# EAGLE schematic board (EAGLE 9.6.2)
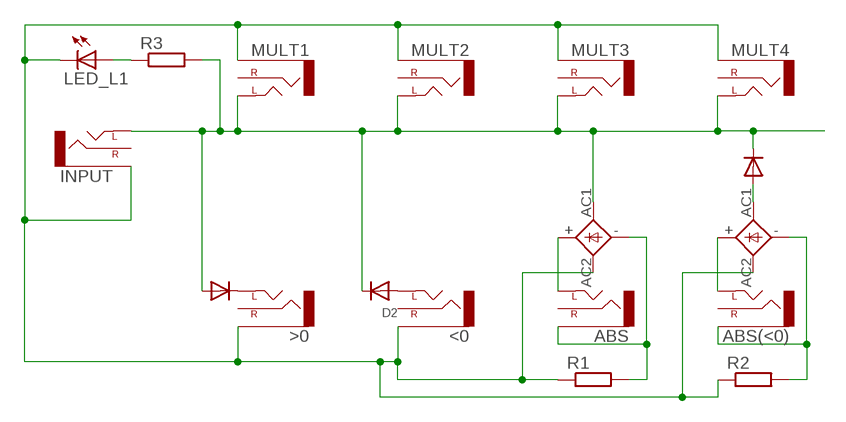
[diagram p0: schematic, sheet 1]

## Parts
<0  THONKI-STEREO  [WQP-PJ366ST_JACK]
>0  THONKI-STEREO  [WQP-PJ366ST_JACK]
ABS  THONKI-STEREO  [WQP-PJ366ST_JACK]
ABS(<0)  THONKI-STEREO  [WQP-PJ366ST_JACK]
B1  2KBB-R  [2KBB-R]
B2  2KBB-R  [2KBB-R]
D1  DIODEDO-1N4148  [DO-1N4148]
D2  DIODEDO-1N4148  [DO-1N4148]
D3  DIODEDO-1N4148  [DO-1N4148]
INPUT  THONKI-STEREO  [WQP-PJ366ST_JACK]
LED_L1  LED3MM  [LED3MM]
MULT1  THONKI-STEREO  [WQP-PJ366ST_JACK]
MULT2  THONKI-STEREO  [WQP-PJ366ST_JACK]
MULT3  THONKI-STEREO  [WQP-PJ366ST_JACK]
MULT4  THONKI-STEREO  [WQP-PJ366ST_JACK]
R1  RESISTOR7MM  [7MM_RESISTOR]
R2  RESISTOR7MM  [7MM_RESISTOR]
R3  RESISTOR7MM  [7MM_RESISTOR]

## Nets
N$1: ABS(<0).P$1_TIP(LEFT) B2.+
N$2: >0.P$1_TIP(LEFT) D1.C
N$3: B2.AC1 D3.A
N$4: LED_L1.A R3.1
N$5: <0.P$1_TIP(LEFT) D2.A
N$6: B1.AC1 D1.A D2.C D3.C INPUT.P$1_TIP(LEFT) MULT1.P$1_TIP(LEFT) MULT2.P$1_TIP(LEFT) MULT3.P$1_TIP(LEFT) MULT4.P$1_TIP(LEFT) R3.2
N$7: <0.P$3_SLEEVE(SLEEVE) >0.P$3_SLEEVE(SLEEVE) B1.AC2 B2.AC2 INPUT.P$3_SLEEVE(SLEEVE) LED_L1.K(C) MULT1.P$3_SLEEVE(SLEEVE) MULT2.P$3_SLEEVE(SLEEVE) MULT3.P$3_SLEEVE(SLEEVE) MULT4.P$3_SLEEVE(SLEEVE) R1.1 R2.1
N$8: ABS.P$3_SLEEVE(SLEEVE) B1.- R1.2
N$9: ABS.P$1_TIP(LEFT) B1.+
N$10: ABS(<0).P$3_SLEEVE(SLEEVE) B2.- R2.2
Unconnected: <0.P$2_SWITCH(RIGHT) >0.P$2_SWITCH(RIGHT) ABS(<0).P$2_SWITCH(RIGHT) ABS.P$2_SWITCH(RIGHT) INPUT.P$2_SWITCH(RIGHT) MULT1.P$2_SWITCH(RIGHT) MULT2.P$2_SWITCH(RIGHT) MULT3.P$2_SWITCH(RIGHT) MULT4.P$2_SWITCH(RIGHT)

## Library data of the parts
<0 >0 ABS ABS(<0) INPUT MULT1-MULT4 = MusicThingModular:THONKI-STEREO: 3.5mm socket for Eurorack modular synths
B1 B2 = rectifier:2KBB-R: RECTIFIER grid 3 x 5 mm
D1-D3 = adafruit:DIODE: Diode SMADIODE - SMA Surface Mount Package 20V 1A Schottky Diode Digikey: 641-1014-6-ND DO-1N4148 - Through Hole Small Current Diode SOD-123 20V 1 A (.5mV Vf) Schottky Diode - Digikey: MBRX120TPMSCT-ND SOD-323 10V 570mA (.38mV Vf, 3ns) Schottky Diode - Digikey: ZLLS410CT-ND SOD-523 30V 30mA Schottky Diode (RB751S-40TE61) - Digikey: RB751S-40TE61CT-ND SOT23-R/W - SOT23 Package (R = Solder Paste/Reflow Ovens, W = Hand-Soldering) BAT54Film 40V 300mA - Digikey: 497-7162-1-ND
LED_L1 = adafruit:LED: LED OSRAM: - CHIPLED LG R971, LG N971, LY N971, LG Q971, LY Q971, LO R971, LY R971 LH N974, LH R974 LS Q976, LO Q976, LY Q976 LO Q996 - Hyper CHIPLED LW Q18S LB Q993, LB Q99A, LB R99A - SideLED LS A670, LO A670, LY A670, LG A670, LP A670 LB A673, LV A673, LT A673, LW A673 LH A674 LY A675 LS A676, LA A676, LO A676, LY A676, LW A676 LS A679, LY A679, LG A679 - Hyper Micro SIDELED® LS Y876, LA Y876, LO Y876, LY Y876 LT Y87S - SmartLED LW L88C, LW L88S LB L89C, LB L89S, LG L890 LS L89K, LO L89K, LY L89K LS L896, LA L896, LO L896, LY L896 - TOPLED LS T670, LO T670, LY T670, LG T670, LP T670 LSG T670, LSP T670, LSY T670, LOP T670, LYG T670 LG T671, LOG T671, LSG T671 LB T673, LV T673, LT T673, LW T673 LH T674 LS T676, LA T676, LO T676, LY T676, LB T676, LH T676, LSB T676, LW T676 LB T67C, LV T67C, LT T67C, LS T67K, LO T67K, LY T67K, LW E67C LS E67B, LA E67B, LO E67B, LY E67B, LB E67C, LV E67C, LT E67C LW T67C LS T679, LY T679, LG T679 LS T770, LO T770, LY T770, LG T770, LP T770 LB T773, LV T773, LT T773, LW T773 LH T774 LS E675, LA E675, LY E675, LS T675 LS T776, LA T776, LO T776, LY T776, LB T776 LHGB T686 LT T68C, LB T68C - Hyper Mini TOPLED® LB M676 - Mini TOPLED Santana® LG M470 LS M47K, LO M47K, LY M47K Source: http://www.osram.convergy.de/
R1-R3 = MusicThingModular:RESISTOR: Standard resistor, various versions